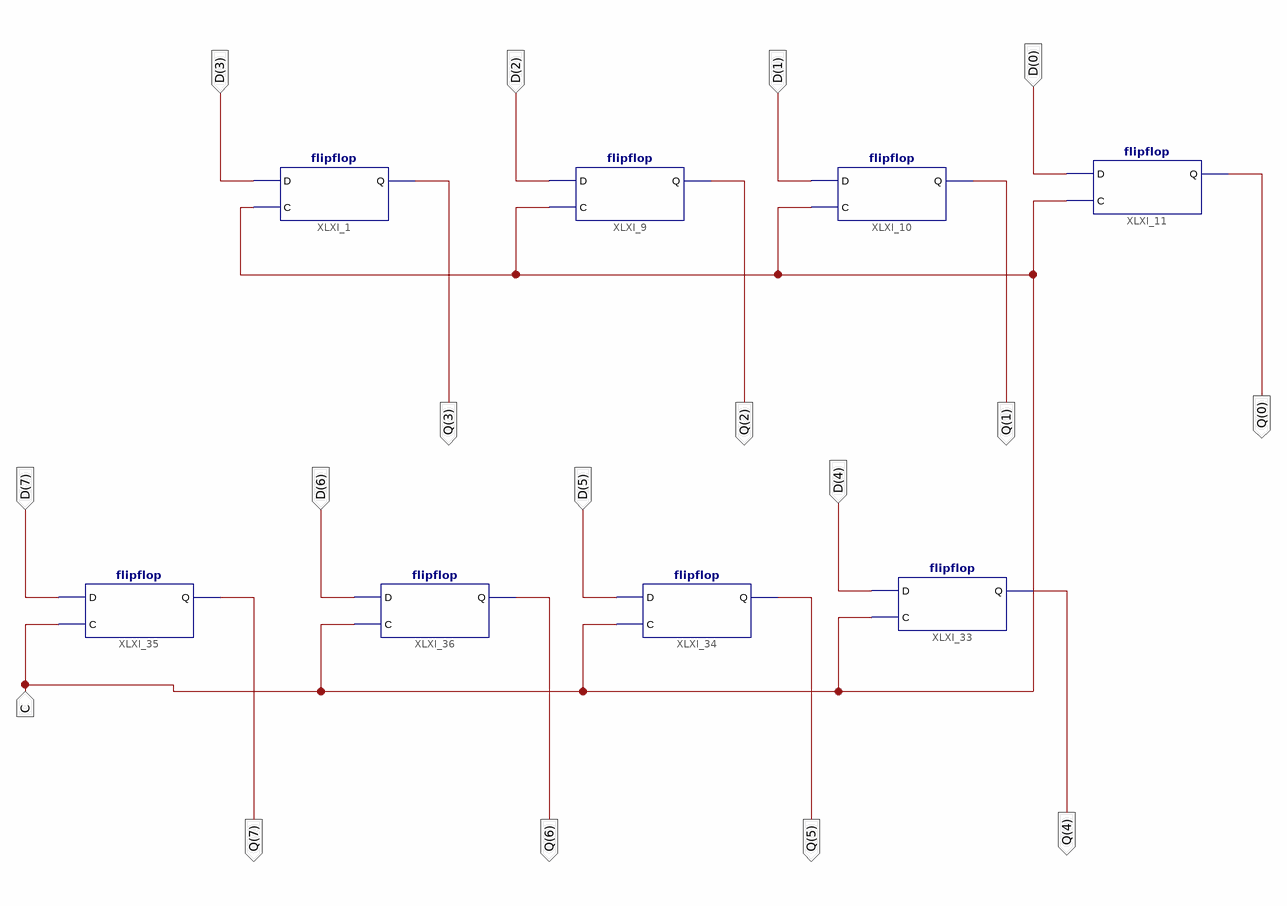
[diagram p0: schematic sheet 1]
// Xilinx ISE schematic register_8bit.sch (spartan6) as structural Verilog: 8 symbols, 17 ports
module register_8bit (
  input  [7:0] D,
  input  C,
  output [7:0] Q
);

  flipflop XLXI_11 (.D(D[0]), .C(C), .Q(Q[0]));
  flipflop XLXI_10 (.D(D[1]), .C(C), .Q(Q[1]));
  flipflop XLXI_1 (.D(D[3]), .C(C), .Q(Q[3]));
  flipflop XLXI_9 (.D(D[2]), .C(C), .Q(Q[2]));
  flipflop XLXI_33 (.D(D[4]), .C(C), .Q(Q[4]));
  flipflop XLXI_34 (.D(D[5]), .C(C), .Q(Q[5]));
  flipflop XLXI_35 (.D(D[7]), .C(C), .Q(Q[7]));
  flipflop XLXI_36 (.D(D[6]), .C(C), .Q(Q[6]));
endmodule
